# Altium schematic sheet mcu.SchDoc
size A4; SheetNumber: 2; SheetTotal: 3
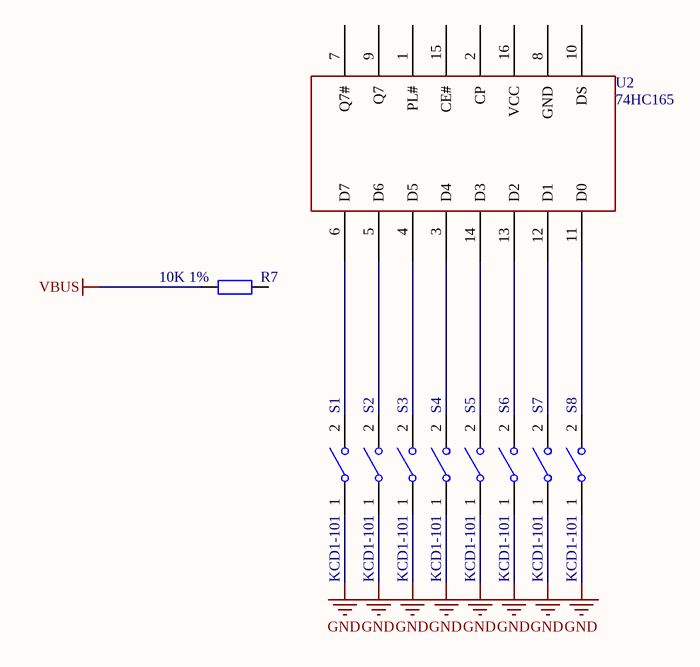
[diagram p0: mcu.SchDoc]

## Parts
R7  10K 1%  [R0402_L]
S1  KCD1-101  [KCD1-101]
S2  KCD1-101  [KCD1-101]
S3  KCD1-101  [KCD1-101]
S4  KCD1-101  [KCD1-101]
S5  KCD1-101  [KCD1-101]
S6  KCD1-101  [KCD1-101]
S7  KCD1-101  [KCD1-101]
S8  KCD1-101  [KCD1-101]
U2  74HC165  [SOP16_L]

## Nets
GND: S1.1 S2.1 S3.1 S4.1 S5.1 S6.1 S7.1 S8.1
VBUS: R7.1
NetS1_2: S1.2 U2.6(D7)
NetS2_2: S2.2 U2.5(D6)
NetS3_2: S3.2 U2.4(D5)
NetS4_2: S4.2 U2.3(D4)
NetS5_2: S5.2 U2.14(D3)
NetS6_2: S6.2 U2.13(D2)
NetS7_2: S7.2 U2.12(D1)
NetS8_2: S8.2 U2.11(D0)

Not connected (* = marked no-connect by the designer): R7 2; U2 1(PL#) 2(CP) 7(Q7#) 8(GND) 9(Q7) 10(DS) 15(CE#) 16(VCC)

## Library data of the parts
R7 = R: 贴片电阻; 版权归属: 源创客; BOM名称: 贴片电阻; 学习资源: www.ooocke.com
S1-S8 = KCD1-101: 1路单刀船型开关; 版权归属: 源创客; BOM名称: 1路单刀船型开关; 学习资源: www.ooocke.com
U2 = 74HC165: 移位寄存器